# Altium schematic sheet Top_Level.SchDoc
size 381 x 241 mm
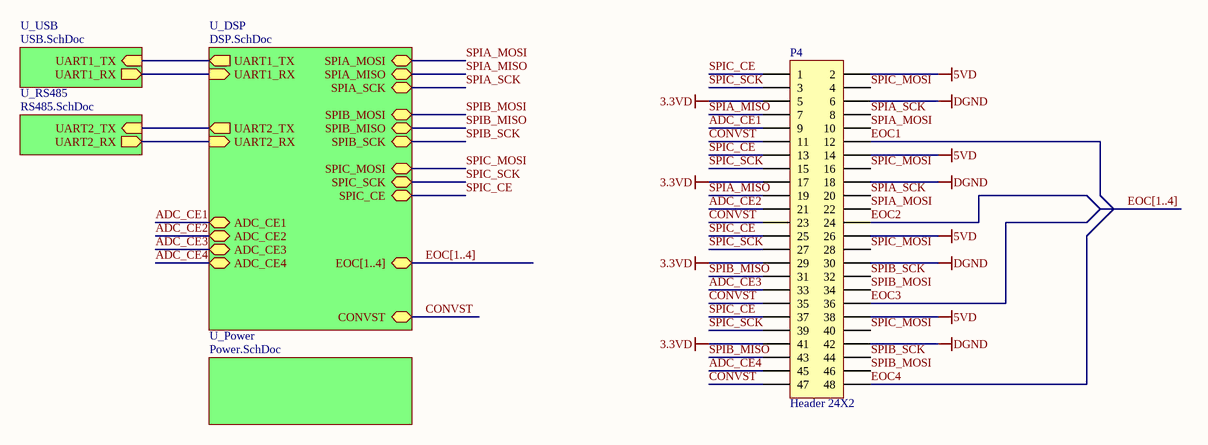
[diagram p0: Top_Level.SchDoc]

## Parts
P4  Header 24X2  [HDR2X24]

## Sub-sheets
U_DSP = DSP.SchDoc: SPIA_MOSI (bidir), SPIA_MISO (bidir), SPIA_SCK (bidir), SPIB_MISO (bidir), SPIB_MOSI (bidir), SPIB_SCK (bidir), SPIC_MOSI (bidir), SPIC_SCK (bidir), SPIC_CE (bidir), CONVST (bidir), ADC_CE1 (bidir), ADC_CE2 (bidir), ADC_CE4 (bidir), ADC_CE3 (bidir), EOC[1..4] (bidir), UART2_TX (out), UART1_TX (out), UART1_RX (in), UART2_RX (in)
U_Power = Power.SchDoc: no entries
U_RS485 = RS485.SchDoc: UART2_RX (out), UART2_TX (in)
U_USB = USB.SchDoc: UART1_RX (out), UART1_TX (in)

## Nets
3.3VD: P4.5 P4.17 P4.29 P4.41
5VD: P4.2 P4.14 P4.26 P4.38
DGND: P4.6 P4.18 P4.30 P4.42
ADC_CE1: P4.9 ; sheet U_DSP/ADC_CE1
ADC_CE2: P4.21 ; sheet U_DSP/ADC_CE2
ADC_CE3: P4.33 ; sheet U_DSP/ADC_CE3
ADC_CE4: P4.45 ; sheet U_DSP/ADC_CE4
CONVST: P4.11 P4.23 P4.35 P4.47 ; sheet U_DSP/CONVST
EOC1: P4.12
EOC2: P4.24
EOC3: P4.36
EOC4: P4.48
SPIA_MISO: P4.7 P4.19 ; sheet U_DSP/SPIA_MISO
SPIA_MOSI: P4.10 P4.22 ; sheet U_DSP/SPIA_MOSI
SPIA_SCK: P4.8 P4.20 ; sheet U_DSP/SPIA_SCK
SPIB_MISO: P4.31 P4.43 ; sheet U_DSP/SPIB_MISO
SPIB_MOSI: P4.34 P4.46 ; sheet U_DSP/SPIB_MOSI
SPIB_SCK: P4.32 P4.44 ; sheet U_DSP/SPIB_SCK
SPIC_CE: P4.1 P4.13 P4.25 P4.37 ; sheet U_DSP/SPIC_CE
SPIC_MOSI: P4.4 P4.16 P4.28 P4.40 ; sheet U_DSP/SPIC_MOSI
SPIC_SCK: P4.3 P4.15 P4.27 P4.39 ; sheet U_DSP/SPIC_SCK
(unnamed): sheet U_DSP/UART2_TX, sheet U_RS485/UART2_TX
(unnamed): sheet U_DSP/UART1_TX, sheet U_USB/UART1_TX
(unnamed): sheet U_DSP/UART1_RX, sheet U_USB/UART1_RX
(unnamed): sheet U_DSP/UART2_RX, sheet U_RS485/UART2_RX

## Buses and harness runs
bus EOC[1..4]
bus EOC[1..4] = sheet U_DSP/EOC[1..4]

## Library data of the parts
P4 = Header 24X2: Header, 24-Pin, Dual row; LatestRevisionDate: 17-Jul-2002; LatestRevisionNote: Re-released for DXP Platform.; Publisher: Altium Limited; Supplier Part Number 1: 952-1917-ND; Supplier 1: Digi-Key